# EAGLE schematic ycpower (EAGLE 5.04)
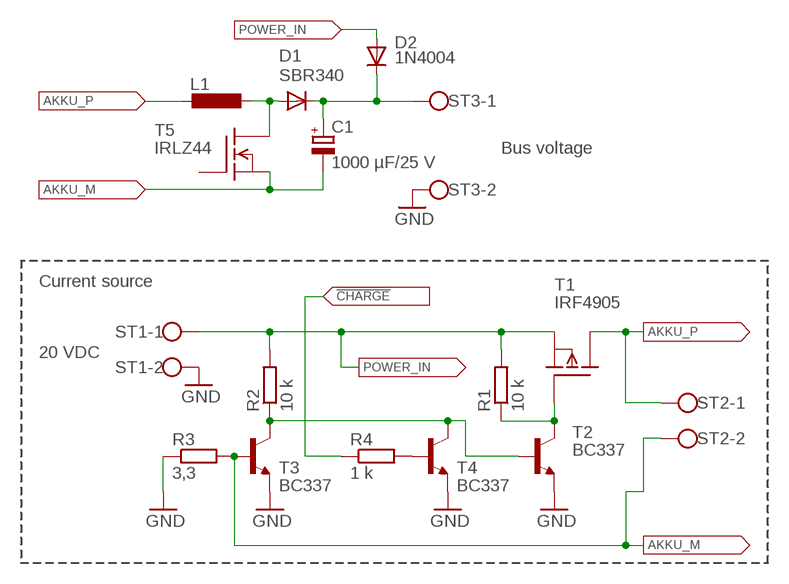
[diagram p0: schematic, sheet 1]

## Parts
C1  1000 µF/25 V  CPOL-EUE10-20  [EB20D]
D1  SBR340  1N5624  [DO201-15]
D2  1N4004  [DO41-10]
L1  L-EUTJ6-U1  [TJ6-U1]
R1  10 k  R-EU_0207/10  [0207/10]
R2  10 k  R-EU_0207/10  [0207/10]
R3  3,3  R-EU_0207/10  [0207/10]
R4  1 k  R-EU_0207/10  [0207/10]
ST1  W237-02P  [W237-132]
ST2  W237-02P  [W237-132]
ST3  W237-02P  [W237-132]
T1  IRF4905  IRF9530  [TO220]
T2  BC337  BC337-16-NPN-TO92-EBC  [TO92-EBC]
T3  BC337  BC337-16-NPN-TO92-EBC  [TO92-EBC]
T4  BC337  BC337-16-NPN-TO92-EBC  [TO92-EBC]
T5  IRLZ44  IRF540  [TO220]

## Nets
!CHARGE: R4.1
AKKU_M: C1.- R3.2 ST2.2 T3.B T5.3(S)
AKKU_P: L1.2 ST2.1 T1.2(D)
GND: R3.1 ST1.2 ST3.2 T2.E T3.E T4.E
N$1: R2.1 T2.B T3.C T4.C
N$2: R1.1 T1.1(G) T2.C
N$3: R4.2 T4.B
N$4: D1.A L1.1 T5.2(D)
N$6: C1.+ D1.C D2.C ST3.1
POWER_IN: D2.A R1.2 R2.2 ST1.1 T1.3(S)
Unconnected: T5.1(G)

## Notes on the sheet
- Bus voltage
- Current source
- 20 VDC

## Library data of the parts
C1 = rcl:CPOL-EU: POLARIZED CAPACITOR, European symbol
D1 = diode:1N5624: DIODE controlled avalanche rectifier
D2 = diode:1N4004: DIODE general purpose rectifier, 1 A
L1 = rcl:L-EU: INDUCTOR, European symbol
R1-R4 = rcl:R-EU_: RESISTOR, European symbol
ST1-ST3 = con-wago-508:W237-02P: WAGO SREW CLAMP
T1 = transistor-fet:IRF9530: P-Channel Enhancement MOSFET (HEXFET); -100V; -12A; 0,3Ohm
T2-T4 = transistor:*-NPN-: NPN Transistror BF959 corrected 2008.03.06
T5 = transistor-fet:IRF540: N-Channel Enhancement MOSFET (HEXFET); 100V; 28A; 0,077Ohm